# EAGLE design programmer-board (EAGLE 7.4.0)
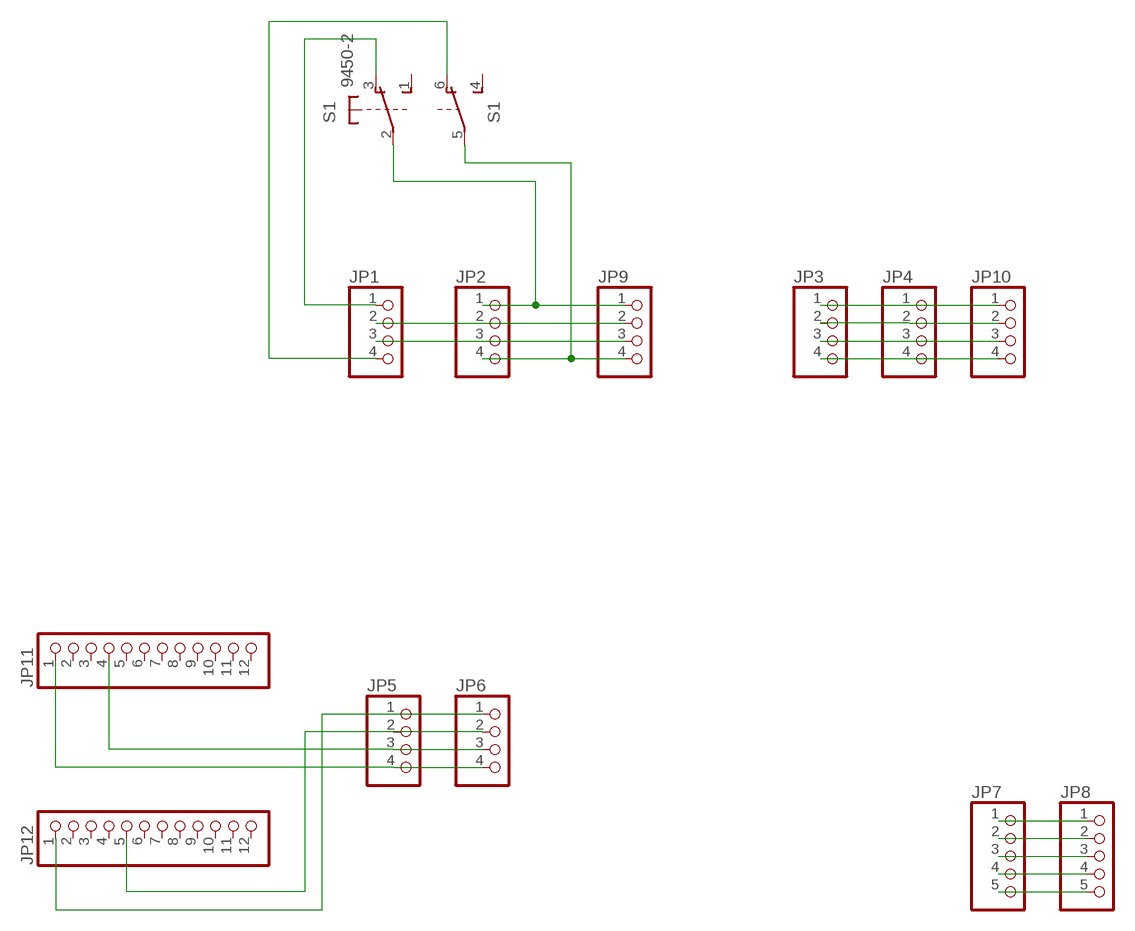
[diagram p0: schematic, sheet 1]

## Parts
JP1  PINHD-1X4  [1X04]
JP2  PINHD-1X4  [1X04]
JP3  PINHD-1X4  [1X04]
JP4  PINHD-1X4  [1X04]
JP5  PINHD-1X4  [1X04]
JP6  PINHD-1X4  [1X04]
JP7  PINHD-1X5  [1X05]
JP8  PINHD-1X5  [1X05]
JP9  PINHD-1X4  [1X04]
JP10  PINHD-1X4  [1X04]
JP11  PINHD-1X12  [1X12]
JP12  PINHD-1X12  [1X12]
S1  9450-2  [9450-2]

## Nets
N$1: JP1.1 S1.3(1:O)
N$2: JP2.1 JP9.1 S1.2(1:P)
N$3: JP1.2 JP2.2 JP9.2
N$4: JP1.3 JP2.3 JP9.3
N$5: JP1.4 S1.6(2:O)
N$6: JP2.4 JP9.4 S1.5(2:P)
N$9: JP3.1 JP4.1 JP10.1
N$10: JP3.2 JP4.2 JP10.2
N$11: JP3.3 JP4.3 JP10.3
N$12: JP3.4 JP4.4 JP10.4
N$13: JP5.1 JP6.1 JP12.1
N$14: JP5.2 JP6.2 JP12.5
N$15: JP5.3 JP6.3 JP11.4
N$16: JP5.4 JP6.4 JP11.1
N$17: JP7.1 JP8.1
N$18: JP7.2 JP8.2
N$19: JP7.3 JP8.3
N$20: JP7.4 JP8.4
N$21: JP7.5 JP8.5
Unconnected: JP11.2 JP11.3 JP11.5 JP11.6 JP11.7 JP11.8 JP11.9 JP11.10 JP11.11 JP11.12 JP12.2 JP12.3 JP12.4 JP12.6 JP12.7 JP12.8 JP12.9 JP12.10 JP12.11 JP12.12 S1.1(1:S) S1.4(2:S)

## Library data of the parts
JP1-JP6 JP9 JP10 = pinhead:PINHD-1X4: PIN HEADER
JP7 JP8 = pinhead:PINHD-1X5: PIN HEADER
JP11 JP12 = pinhead:PINHD-1X12: PIN HEADER
S1 = switch-misc:9450-2: MARQUARDT SWITCH

## Board
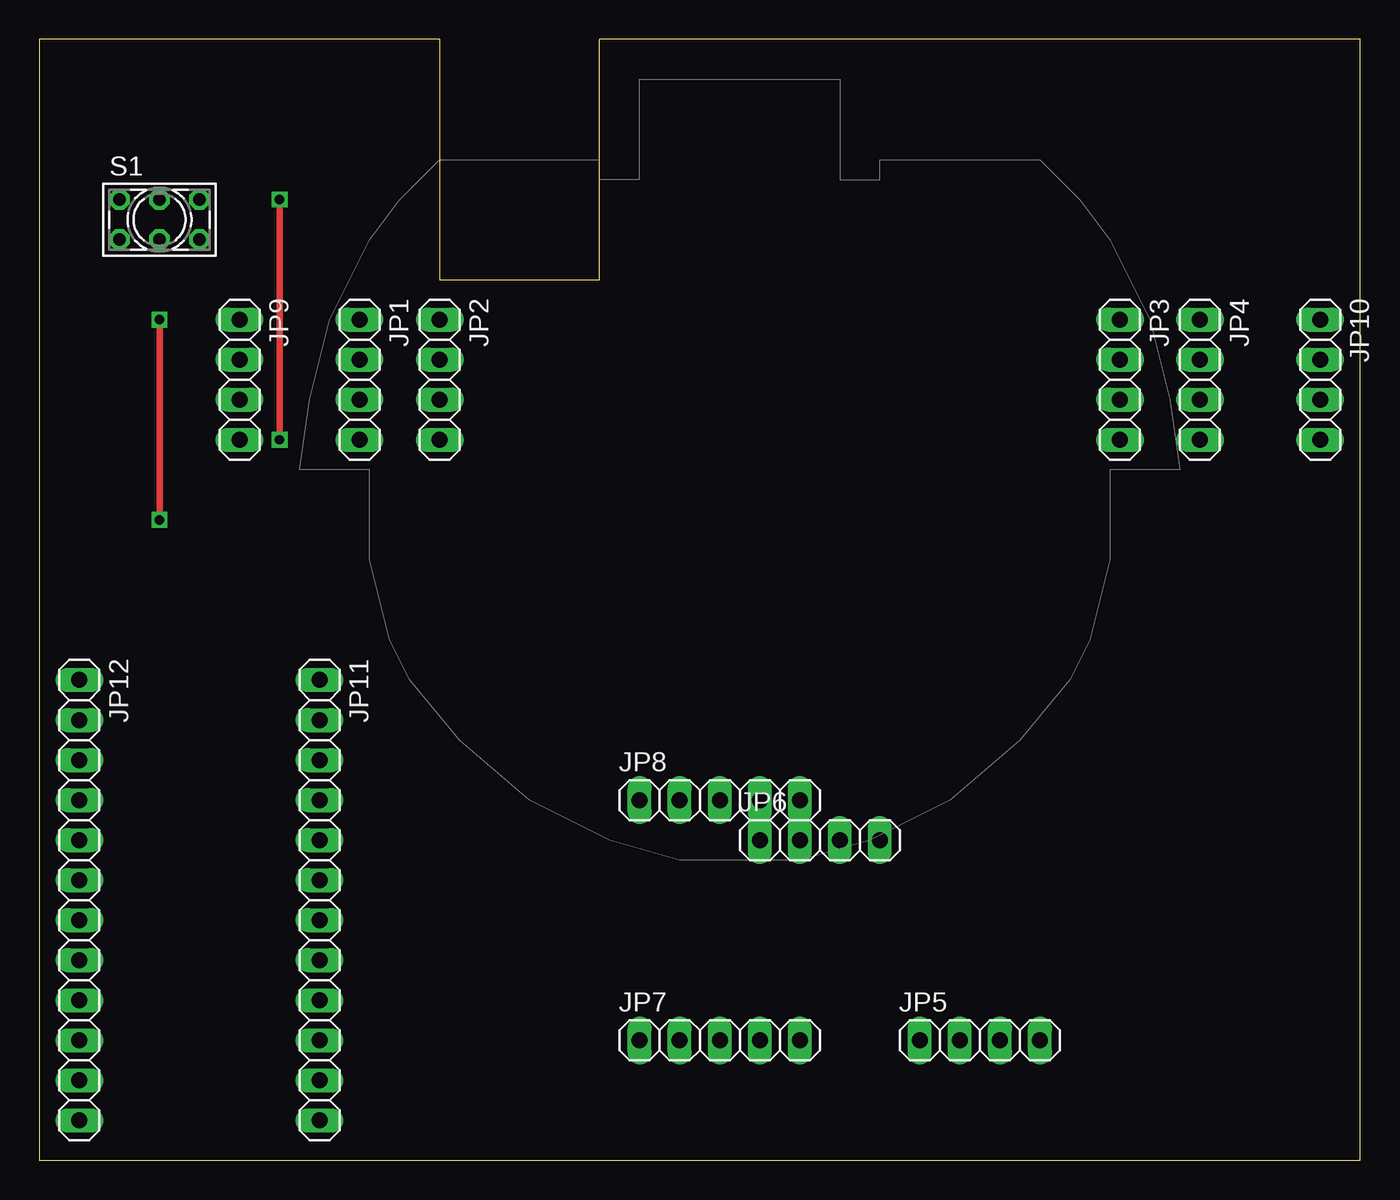
[diagram p1: board, top side]
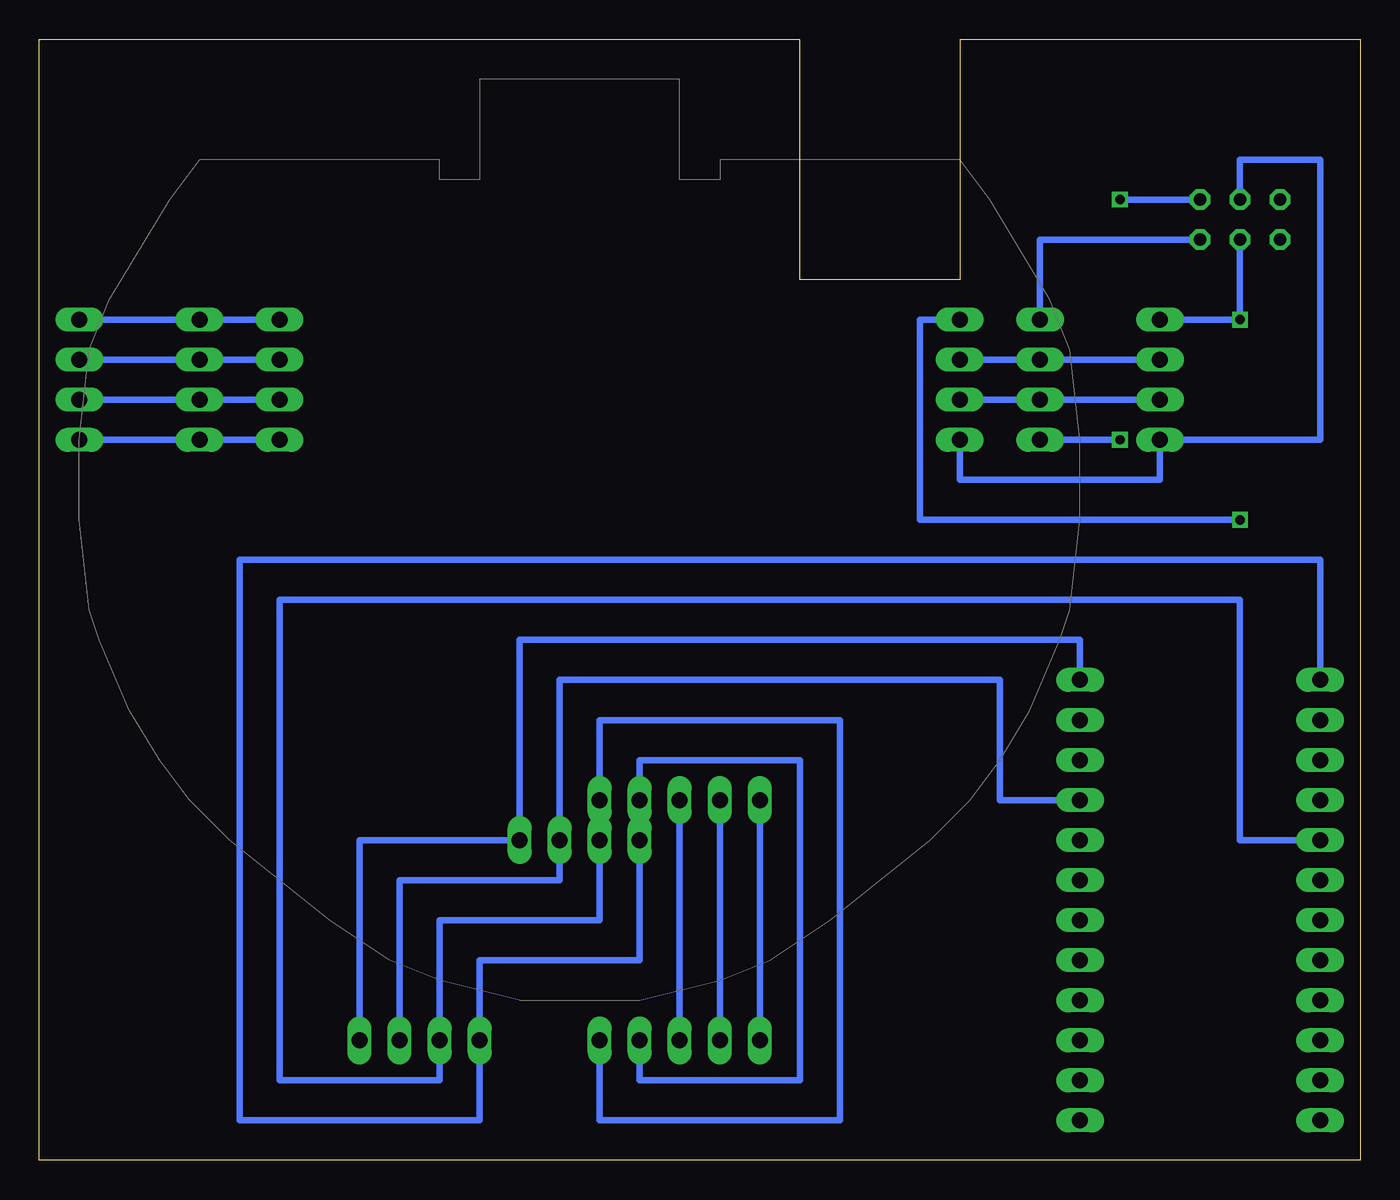
[diagram p2: board, bottom side, seen from below]

Size 83.82 x 71.12 mm. Coordinates in mm from the lower left corner, seen from the top.
Outline: 0,0 83.82,0 83.82,71.12 35.56,71.12 35.56,55.88 25.4,55.88 25.4,71.12 0,71.12 0,0
Copper layers (1*16): Top 0.035mm / dielectric 1.5mm / Bottom 0.035mm
Design rules "default": minimum track width 10mil, minimum drill 24mil, track to track 8mil, track to pad 8mil, pad to pad 8mil, via to via 8mil, smd to smd 8mil, copper to edge 40mil, drill to drill 8mil, minimum pad ring 10mil, minimum via ring 8mil, stop-mask expansion 4mil, vias tented up to drill 0mil, thermal gap 10mil

### Footprints (pad centres in the part's own frame; a part is rotated, then mirrored left to right if it is on the bottom)
1X04 = drill 1.016 long: 1 -3.81,0; 2 -1.27,0; 3 1.27,0; 4 3.81,0
1X05 = drill 1.016 long: 1 -5.08,0; 2 -2.54,0; 3 0,0; 4 2.54,0; 5 5.08,0
1X12 = drill 1.016 long: 1 -13.97,0; 2 -11.43,0; 3 -8.89,0; 4 -6.35,0; 5 -3.81,0; 6 -1.27,0; 7 1.27,0; 8 3.81,0; 9 6.35,0; 10 8.89,0; 11 11.43,0; 12 13.97,0
9450-2 = drill 0.813 octagon: 1 -2.54,-1.27; 2 0,-1.27; 3 2.54,-1.27; 4 -2.54,1.27; 5 0,1.27; 6 2.54,1.27

### Placement (x,y rotation side)
JP1  20.32,49.53 270 top
JP2  25.4,49.53 270 top
JP3  68.58,49.53 270 top
JP4  73.66,49.53 270 top
JP5  59.69,7.62 0 top
JP6  49.53,20.32 0 top
JP7  43.18,7.62 0 top
JP8  43.18,22.86 0 top
JP9  12.7,49.53 270 top
JP10  81.28,49.53 270 top
JP11  17.78,16.51 270 top
JP12  2.54,16.51 270 top
S1  7.62,59.69 0 top

### Tracks (layer width: path | path; a pad name or v marks a point on that pad's centre or on a via)
N$1
  Bottom 0.406: JP1.1 20.32,58.42 S1.3
N$2  (via drill 0.6)
  Top 0.406: v7.62,53.34 v7.62,40.64
  Bottom 0.406: S1.2 v7.62,53.34 JP9.1 | v7.62,40.64 27.94,40.64 27.94,53.34 JP2.1
N$3
  Bottom 0.406: JP2.2 JP1.2 JP9.2
N$4
  Bottom 0.406: JP2.3 JP1.3 JP9.3
N$5  (via drill 0.6)
  Top 0.406: v15.24,45.72 v15.24,60.96
  Bottom 0.406: JP1.4 v15.24,45.72 | S1.6 v15.24,60.96
N$6
  Bottom 0.406: JP2.4 25.4,43.18 12.7,43.18 JP9.4 2.54,45.72 2.54,63.5 7.62,63.5 S1.5
N$9
  Bottom 0.406: JP3.1 JP4.1 JP10.1
N$10
  Bottom 0.406: JP3.2 JP4.2 JP10.2
N$11
  Bottom 0.406: JP3.3 JP4.3 JP10.3
N$12
  Bottom 0.406: JP3.4 JP4.4 JP10.4
N$13
  Bottom 0.406: JP12.1 2.54,38.1 71.12,38.1 71.12,2.54 55.88,2.54 JP5.1 55.88,12.7 45.72,12.7 JP6.1
N$14
  Bottom 0.406: JP6.2 48.26,15.24 58.42,15.24 JP5.2 58.42,5.08 68.58,5.08 68.58,35.56 7.62,35.56 7.62,20.32 JP12.5
N$15
  Bottom 0.406: JP5.3 60.96,17.78 50.8,17.78 JP6.3 50.8,30.48 22.86,30.48 22.86,22.86 JP11.4
N$16
  Bottom 0.406: JP5.4 63.5,20.32 JP6.4 53.34,33.02 17.78,33.02 JP11.1
N$17
  Bottom 0.406: JP8.1 JP7.1
N$18
  Bottom 0.406: JP8.2 JP7.2
N$19
  Bottom 0.406: JP8.3 JP7.3
N$20
  Bottom 0.406: JP8.4 45.72,25.4 35.56,25.4 35.56,5.08 45.72,5.08 JP7.4
N$21
  Bottom 0.406: JP7.5 48.26,2.54 33.02,2.54 33.02,27.94 48.26,27.94 JP8.5